# Altium schematic sheet 消防灭火小车ASCII.SchDoc
size A3
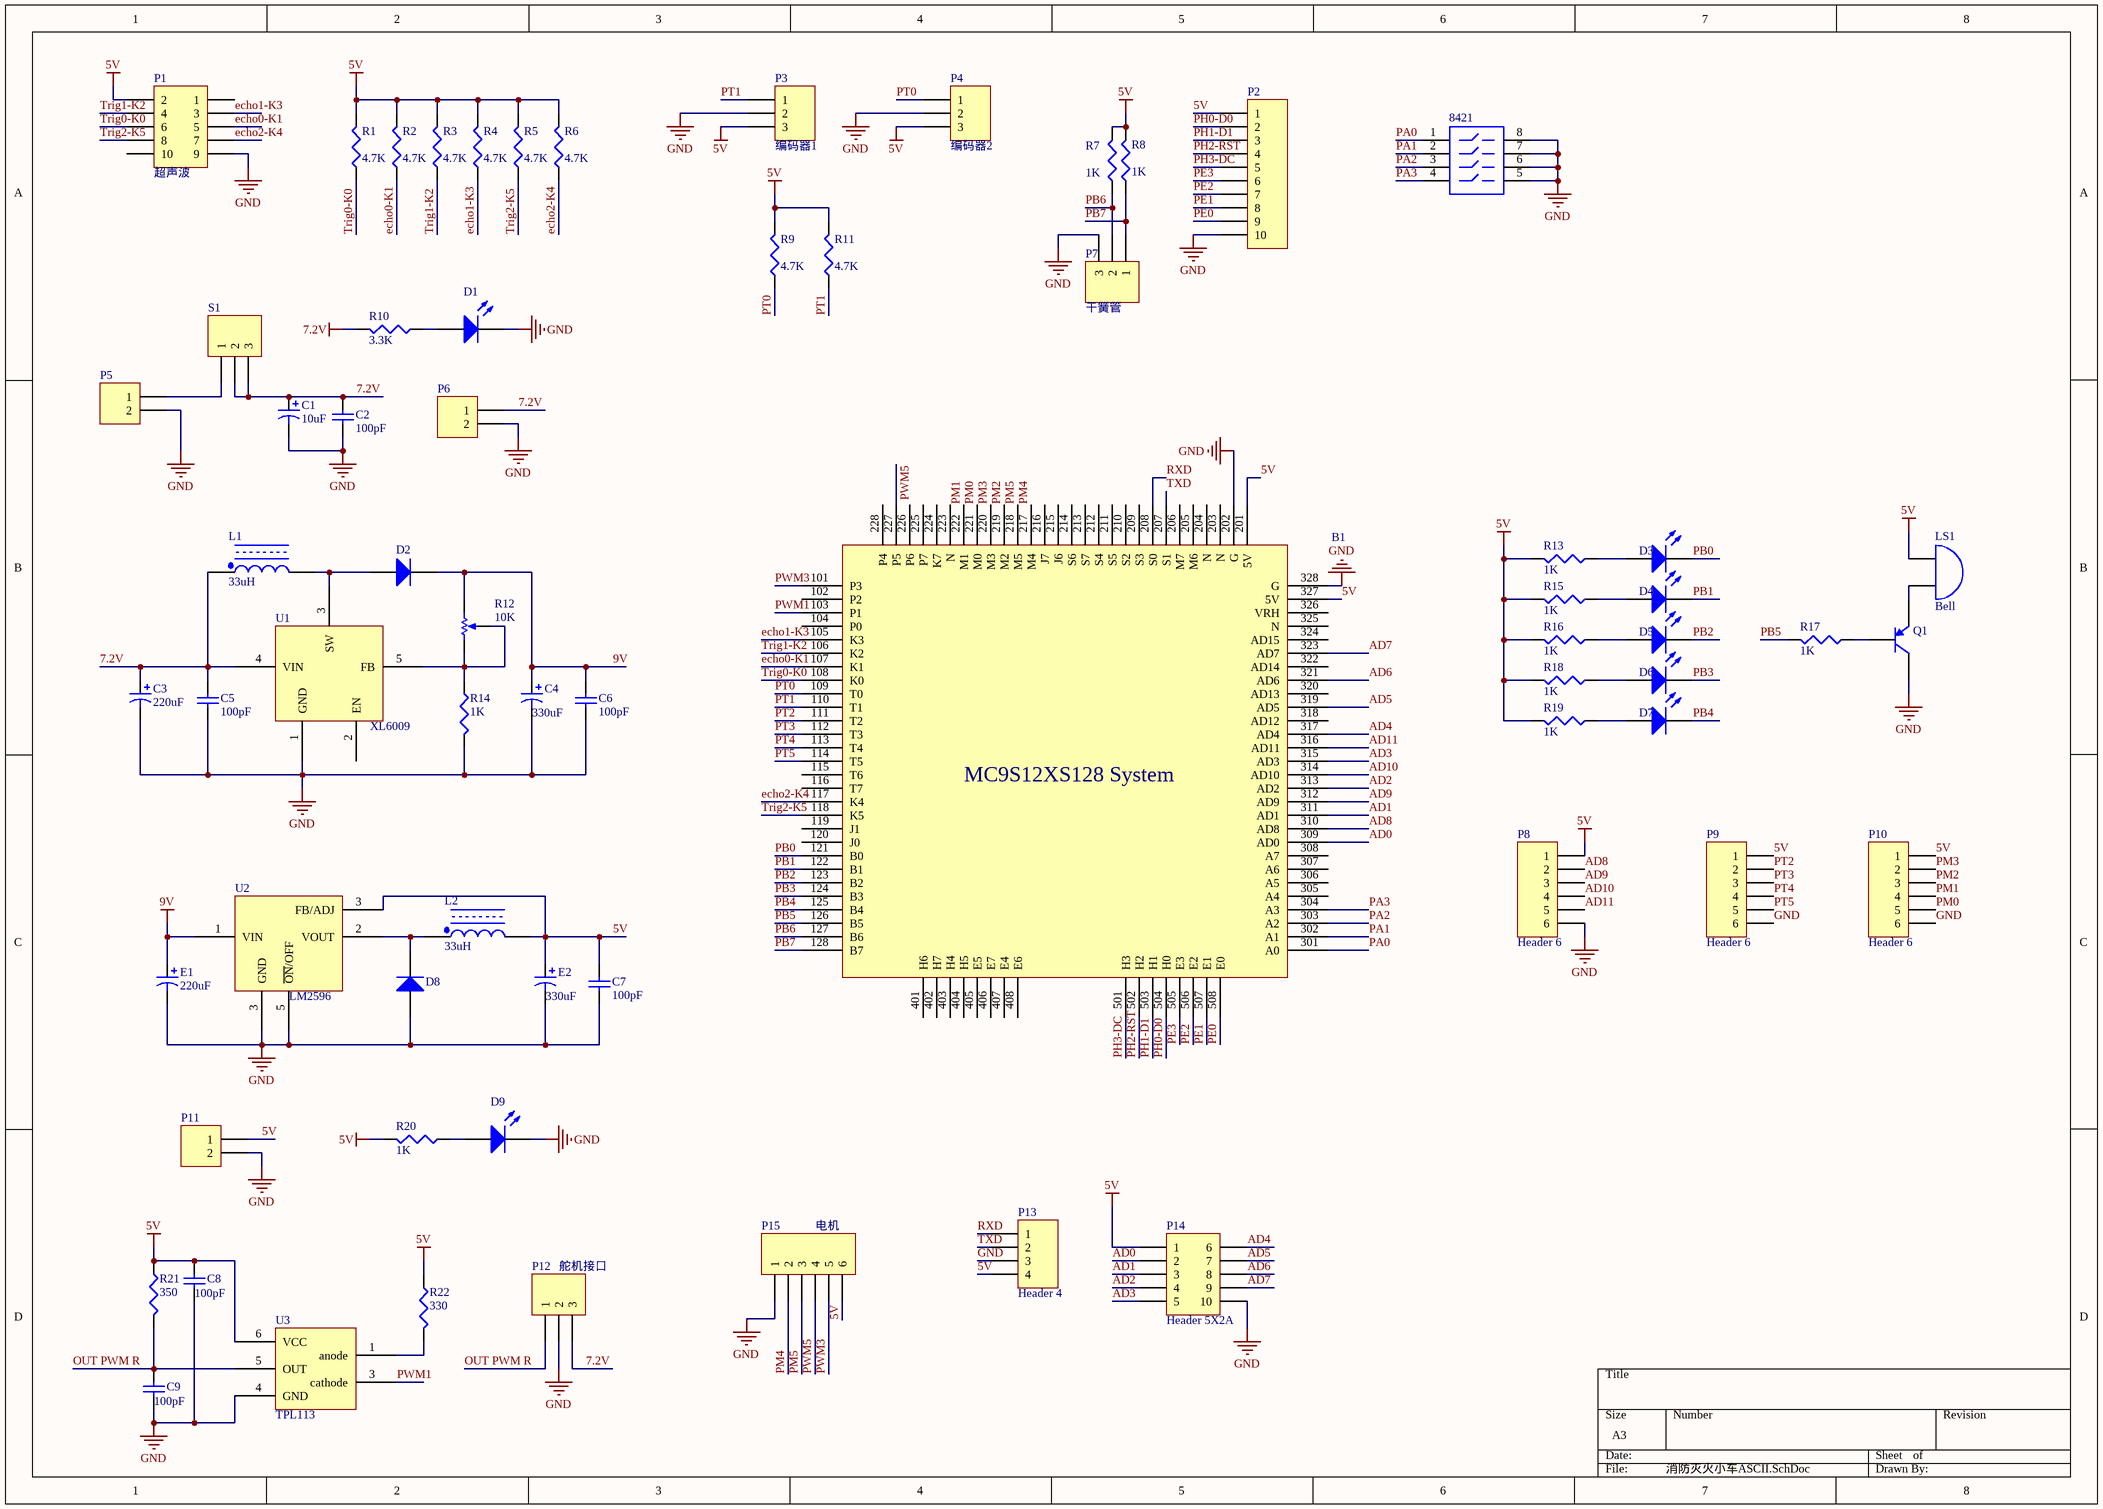
[diagram p0: 消防灭火小车ASCII.SchDoc]

## Parts
8421  SW-DIP4  [DIP-8]  (value not drawn)
B1  Component_1  [XS128]  (value not drawn)
C1  value 10uF  [C0805]  (hidden comment: Cap Pol3)
C2  value 100pF  [C1206]  (hidden comment: Cap Semi)
C3  value 220uF  [C0805]  (hidden comment: Cap Pol3)
C4  value 330uF  [C0805]  (hidden comment: Cap Pol3)
C5  value 100pF  [C1206]  (hidden comment: Cap Semi)
C6  value 100pF  [C1206]  (hidden comment: Cap Semi)
C7  value 100pF  [C1206]  (hidden comment: Cap Semi)
C8  value 100pF  [C1206]  (hidden comment: Cap Semi)
C9  value 100pF  [C1206]  (hidden comment: Cap Semi)
D1  LED2  [3.2X1.6X1.1]  (value not drawn)
D2  Diode  [SMC]  (value not drawn)
D3  LED2  [3.2X1.6X1.1]  (value not drawn)
D4  LED2  [3.2X1.6X1.1]  (value not drawn)
D5  LED2  [3.2X1.6X1.1]  (value not drawn)
D6  LED2  [3.2X1.6X1.1]  (value not drawn)
D7  LED2  [3.2X1.6X1.1]  (value not drawn)
D8  Diode  [SMC]  (value not drawn)
D9  LED2  [3.2X1.6X1.1]  (value not drawn)
E1  value 220uF  [C0805]  (hidden comment: Cap Pol3)
E2  value 330uF  [C0805]  (hidden comment: Cap Pol3)
L1  value 33uH  [425]  (hidden comment: Inductor Isolated)
L2  value 33uH  [425]  (hidden comment: Inductor Isolated)
LS1  Bell  [PIN2]
P1  超声波  [MHDR2X5]
P2  Header 10  [HDR1X10]  (value not drawn)
P3  编码器1  [HDR1X3]
P4  编码器2  [HDR1X3]
P5  Header 2  [HDR1X2]  (value not drawn)
P6  Header 2  [HDR1X2]  (value not drawn)
P7  干簧管  [HDR1X3]
P8  Header 6  [HDR1X6]
P9  Header 6  [HDR1X6]
P10  Header 6  [HDR1X6]
P11  Header 2  [HDR1X2]  (value not drawn)
P12  舵机接口  [HDR1X3]
P13  Header 4  [HDR1X4]
P14  Header 5X2A  [HDR2X5_CEN]
P15  电机  [HDR1X6]
Q1  2N3906  [TO-92A]  (value not drawn)
R1  value 4.7K  [J1-0603]  (hidden comment: Res3)
R2  value 4.7K  [J1-0603]  (hidden comment: Res3)
R3  value 4.7K  [J1-0603]  (hidden comment: Res3)
R4  value 4.7K  [J1-0603]  (hidden comment: Res3)
R5  value 4.7K  [J1-0603]  (hidden comment: Res3)
R6  value 4.7K  [J1-0603]  (hidden comment: Res3)
R7  value 1K  [J1-0603]  (hidden comment: Res3)
R8  value 1K  [J1-0603]  (hidden comment: Res3)
R9  value 4.7K  [J1-0603]  (hidden comment: Res3)
R10  value 3.3K  [J1-0603]  (hidden comment: Res3)
R11  value 4.7K  [J1-0603]  (hidden comment: Res3)
R12  value 10K  [VR5]  (hidden comment: RPot)
R13  value 1K  [J1-0603]  (hidden comment: Res3)
R14  value 1K  [J1-0603]  (hidden comment: Res3)
R15  value 1K  [J1-0603]  (hidden comment: Res3)
R16  value 1K  [J1-0603]  (hidden comment: Res3)
R17  value 1K  [J1-0603]  (hidden comment: Res3)
R18  value 1K  [J1-0603]  (hidden comment: Res3)
R19  value 1K  [J1-0603]  (hidden comment: Res3)
R20  value 1K  [J1-0603]  (hidden comment: Res3)
R21  value 350  [J1-0603]  (hidden comment: Res3)
R22  value 330  [J1-0603]  (hidden comment: Res3)
S1  Header 3  [HDR1X3]  (value not drawn)
U1  XL6009  [XL6009E1]
U2  LM2596  [LM2596]
U3  TPL113  [TLP113]

## Nets
5V: B1.201(5V) B1.327(5V) C7.2 C8.2 E2.1 L2.2 LS1.1(A) P1.2 P2.1 P3.3 P4.3 P8.1 P9.1 P10.1 P11.1 P13.4 P14.1 P15.6 R1.2 R2.2 R3.2 R4.2 R5.2 R6.2 R7.2 R8.2 R9.2 R11.2 R13.2 R15.2 R16.2 R18.2 R19.2 R20.2 R21.1 R22.1 U2.3(FB/ADJ) U3.6(VCC)
7.2V: C1.1 C2.2 C3.1 C5.2 L1.1 P6.1 P12.3 R10.2 S1.2 S1.3 U1.4(VIN)
9V: C4.1 C6.2 D2.2(K) E1.1 R12.2(BOT) U2.1(VIN)
GND: 8421.5 8421.6 8421.7 8421.8 B1.202(G) B1.328(G) C1.2 C2.1 C3.2 C4.2 C5.1 C6.1 C7.1 C8.1 C9.1 D1.2(K) D8.1(A) D9.2(K) E1.2 E2.2 P1.9 P2.10 P3.2 P4.2 P5.2 P6.2 P7.3 P8.6 P9.6 P10.6 P11.2 P12.2 P13.3 P14.10 P15.1 Q1.3(C) R14.2 U1.1(GND) U2.3(GND) U2.5(~{ON}/OFF) U3.4(GND)
AD0: B1.309(AD0) P14.2
AD1: B1.311(AD1) P14.3
AD2: B1.313(AD2) P14.4
AD3: B1.315(AD3) P14.5
AD4: B1.317(AD4) P14.6
AD5: B1.319(AD5) P14.7
AD6: B1.321(AD6) P14.8
AD7: B1.323(AD7) P14.9
AD8: B1.310(AD8) P8.2
AD9: B1.312(AD9) P8.3
AD10: B1.314(AD10) P8.4
AD11: B1.316(AD11) P8.5
echo0-K1: B1.107(K1) P1.5 R2.1
echo1-K3: B1.105(K3) P1.3 R4.1
echo2-K4: B1.117(K4) P1.7 R6.1
OUT PWM R: C9.2 P12.1 R21.2 U3.5(OUT)
PA0: 8421.1 B1.301(A0)
PA1: 8421.2 B1.302(A1)
PA2: 8421.3 B1.303(A2)
PA3: 8421.4 B1.304(A3)
PB0: B1.121(B0) D3.2(K)
PB1: B1.122(B1) D4.2(K)
PB2: B1.123(B2) D5.2(K)
PB3: B1.124(B3) D6.2(K)
PB4: B1.125(B4) D7.2(K)
PB5: B1.126(B5) R17.2
PB6: B1.127(B6) P7.2 R7.1
PB7: B1.128(B7) P7.1 R8.1
PE0: B1.508(E0) P2.9
PE1: B1.507(E1) P2.8
PE2: B1.506(E2) P2.7
PE3: B1.505(E3) P2.6
PH0-D0: B1.504(H0) P2.2
PH1-D1: B1.503(H1) P2.3
PH2-RST: B1.502(H2) P2.4
PH3-DC: B1.501(H3) P2.5
PM0: B1.221(M0) P10.5
PM1: B1.222(M1) P10.4
PM2: B1.219(M2) P10.3
PM3: B1.220(M3) P10.2
PM4: B1.217(M4) P15.2
PM5: B1.218(M5) P15.3
PT0: B1.109(T0) P4.1 R9.1
PT1: B1.110(T1) P3.1 R11.1
PT2: B1.111(T2) P9.2
PT3: B1.112(T3) P9.3
PT4: B1.113(T4) P9.4
PT5: B1.114(T5) P9.5
PWM1: B1.103(P1) U3.3(cathode)
PWM3: B1.101(P3) P15.5
PWM5: B1.227(P5) P15.4
RXD: B1.208(S0) P13.1
Trig0-K0: B1.108(K0) P1.6 R1.1
Trig1-K2: B1.106(K2) P1.4 R3.1
Trig2-K5: B1.118(K5) P1.8 R5.1
TXD: B1.207(S1) P13.2
NetD1_1: D1.1(A) R10.1
NetD2_1: D2.1(A) L1.2 U1.3(SW)
NetD3_1: D3.1(A) R13.1
NetD4_1: D4.1(A) R15.1
NetD5_1: D5.1(A) R16.1
NetD6_1: D6.1(A) R18.1
NetD7_1: D7.1(A) R19.1
NetD8_2: D8.2(K) L2.1 U2.2(VOUT)
NetD9_1: D9.1(A) R20.1
NetLS1_2: LS1.2(B) Q1.1(E)
NetP5_1: P5.1 S1.1
NetQ1_2: Q1.2(B) R17.1
NetR12_1: R12.1(TOP) R12.3(TAP) R14.1 U1.5(FB)
NetR22_2: R22.2 U3.1(anode)

Not connected (* = marked no-connect by the designer): B1 102(P2) 104(P0) 115(T6) 116(T7) 119(J1) 120(J0) 203(N) 204(N) 205(M6) 206(M7) 209(S3) 210(S2) 211(S5) 212(S4) 213(S7) 214(S6) 215(J6) 216(J7) 223(N) 224(K7) 225(P7) 226(P6) 228(P4) 305(A4) 306(A5) 307(A6) 308(A7) 318(AD12) 320(AD13) 322(AD14) 324(AD15) 325(N) 326(VRH) 401(H6) 402(H7) 403(H4) 404(H5) 405(E5) 406(E7) 407(E4) 408(E6); P1 1 10; U1 2(EN)

## Notes on the sheet
- (in symbol Component_1) MC9S12XS128 System

## Library data of the parts
8421 = SW-DIP4: DIP Switch; Published: 24-Mar-1999; LatestRevisionDate: 17-Jul-2002; LatestRevisionNote: Re-released for DXP Platform.; PackageReference: DIP-8; Publisher: Altium Limited
C1 C3 C4 E1 E2 = Cap Pol3: Polarized Capacitor (Surface Mount); Published: 8-Jun-2000; LatestRevisionDate: 29-May-2009; LatestRevisionNote: IPC-7351 Footprint Added.; PackageReference: C0805; Publisher: Altium Limited; PackageDescription: Chip Capacitor
C2 C5-C9 = Cap Semi: Capacitor (Semiconductor SIM Model); Published: 8-Jun-2000; LatestRevisionDate: 29-May-2009; LatestRevisionNote: IPC-7351 Footprint Added.; PackageReference: C1206; Publisher: Altium Limited; PackageDescription: Chip Capacitor
D1 D3-D7 D9 = LED2: Typical RED, GREEN, YELLOW, AMBER GaAs LED; Published: 8-Jun-2000; LatestRevisionDate: 17-Jul-2002; LatestRevisionNote: Re-released for DXP Platform.; PackageVersion: Feb-2002; PackageReference: 3.2X1.6X1.1; Publisher: Altium Limited; PackageDescription: SM LED; 2 Flat Leads
D2 D8 = Diode: Default Diode; Published: 8-Jun-2000; LatestRevisionDate: 17-Jul-2002; LatestRevisionNote: Re-released for DXP Platform.; PackageVersion: Sep-1996; PackageReference: SMC; Publisher: Altium Limited; PackageDescription: DO-214-AB/SMC; 2 C-Bend Leads; Body 7.9 x 5.9 mm, inc. leads (LxW); Code_JEDEC: DO-214-AB
L1 L2 = Inductor Isolated: Isolated Inductor; Published: 24-Mar-1999; LatestRevisionDate: 17-Jul-2002; LatestRevisionNote: Re-released for DXP Platform.; PackageVersion: 1988; PackageReference: 425; Publisher: Altium Limited; PackageDescription: SOD-123; 2 Leads; Body 2.7 x 1.6 mm, (LxW)
LS1 = Bell: Electrical Bell; Published: 24-Mar-1999; LatestRevisionDate: 17-Jul-2002; LatestRevisionNote: Re-released for DXP Platform.; PackageReference: PIN2; Publisher: Altium Limited
P1 = MHDR2X5: Header, 5-Pin, Dual row; LatestRevisionDate: 17-Jul-2002; LatestRevisionNote: Re-released for DXP Platform.; Publisher: Altium Limited
P2 = Header 10: Header, 10-Pin; LatestRevisionDate: 17-Jul-2002; LatestRevisionNote: Re-released for DXP Platform.; Publisher: Altium Limited
P3 P4 P7 P12 S1 = Header 3: Header, 3-Pin; LatestRevisionDate: 17-Jul-2002; LatestRevisionNote: Re-released for DXP Platform.; Publisher: Altium Limited
P5 P6 P11 = Header 2: Header, 2-Pin; LatestRevisionDate: 17-Jul-2002; LatestRevisionNote: Re-released for DXP Platform.; Publisher: Altium Limited
P8-P10 P15 = Header 6: Header, 6-Pin; LatestRevisionDate: 17-Jul-2002; LatestRevisionNote: Re-released for DXP Platform.; Publisher: Altium Limited
P13 = Header 4: Header, 4-Pin; LatestRevisionDate: 17-Jul-2002; LatestRevisionNote: Re-released for DXP Platform.; Publisher: Altium Limited
P14 = Header 5X2A: Header, 5-Pin, Dual row; LatestRevisionDate: 17-Jul-2002; LatestRevisionNote: Re-released for DXP Platform.; Publisher: Altium Limited
Q1 = 2N3906: PNP General Purpose Amplifier; Published: 8-Jun-2000; LatestRevisionDate: 15-Jan-2003; LatestRevisionNote: PCB Footprint 'BCY-W3/D4.7' replaced; DatasheetVersion: 1997; PackageVersion: Sep-1998; PackageReference: TO-92A; Publisher: Altium Limited; PackageDescription: TO, Flat Index; 3 In-Line, Axial Leads; Body Dia. 4.5mm; Leads 0.51 x 0.48 mm (max); ComponentLink1Description: Manufacturer Link; ComponentLink1URL: http://www.fairchildsemi.com/; ComponentLink2Description: Datasheet; ComponentLink2URL: http://www.fairchildsemi.com/ds/2N%2F2N3906.pdf
R1-R11 R13-R22 = Res3: Resistor; Published: 8-Jun-2000; LatestRevisionDate: 29-May-2009; LatestRevisionNote: IPC-7351 Footprint Added.; PackageReference: J1-0603; Publisher: Altium Limited; PackageDescription: Chip Resistor
R12 = RPot: Potentiometer; Sim Note: Enter the Resistance value and the set point into parameter fields.; Set Position: 0.5; Published: 8-Jun-2000; LatestRevisionDate: 17-Jul-2002; LatestRevisionNote: Re-released for DXP Platform.; PackageReference: VR5; Publisher: Altium Limited; PackageDescription: Variable Resistor, Thru-Hole; 3 Leads
U1-U3 = Component_1